# Altium schematic sheet LPCB221 - G210X INTERFACE.SchDoc
size A3; Address1: Factory 10; Address2: 9-13 Dingley Avenue, Dandeong, VICTORIA 3175, AUSTRALIA; DocumentNumber: 3; Revision: 1; SheetNumber: 3; SheetTotal: 6; Lockie__PCB_SUB_ASSEMBLY: G210X Interface; Lockie__PCB_ASSEMBLY: Node Base; Lockie__LDL: LPCB221; Lockie__PCB_DESCRIPTION: Gimbal Node
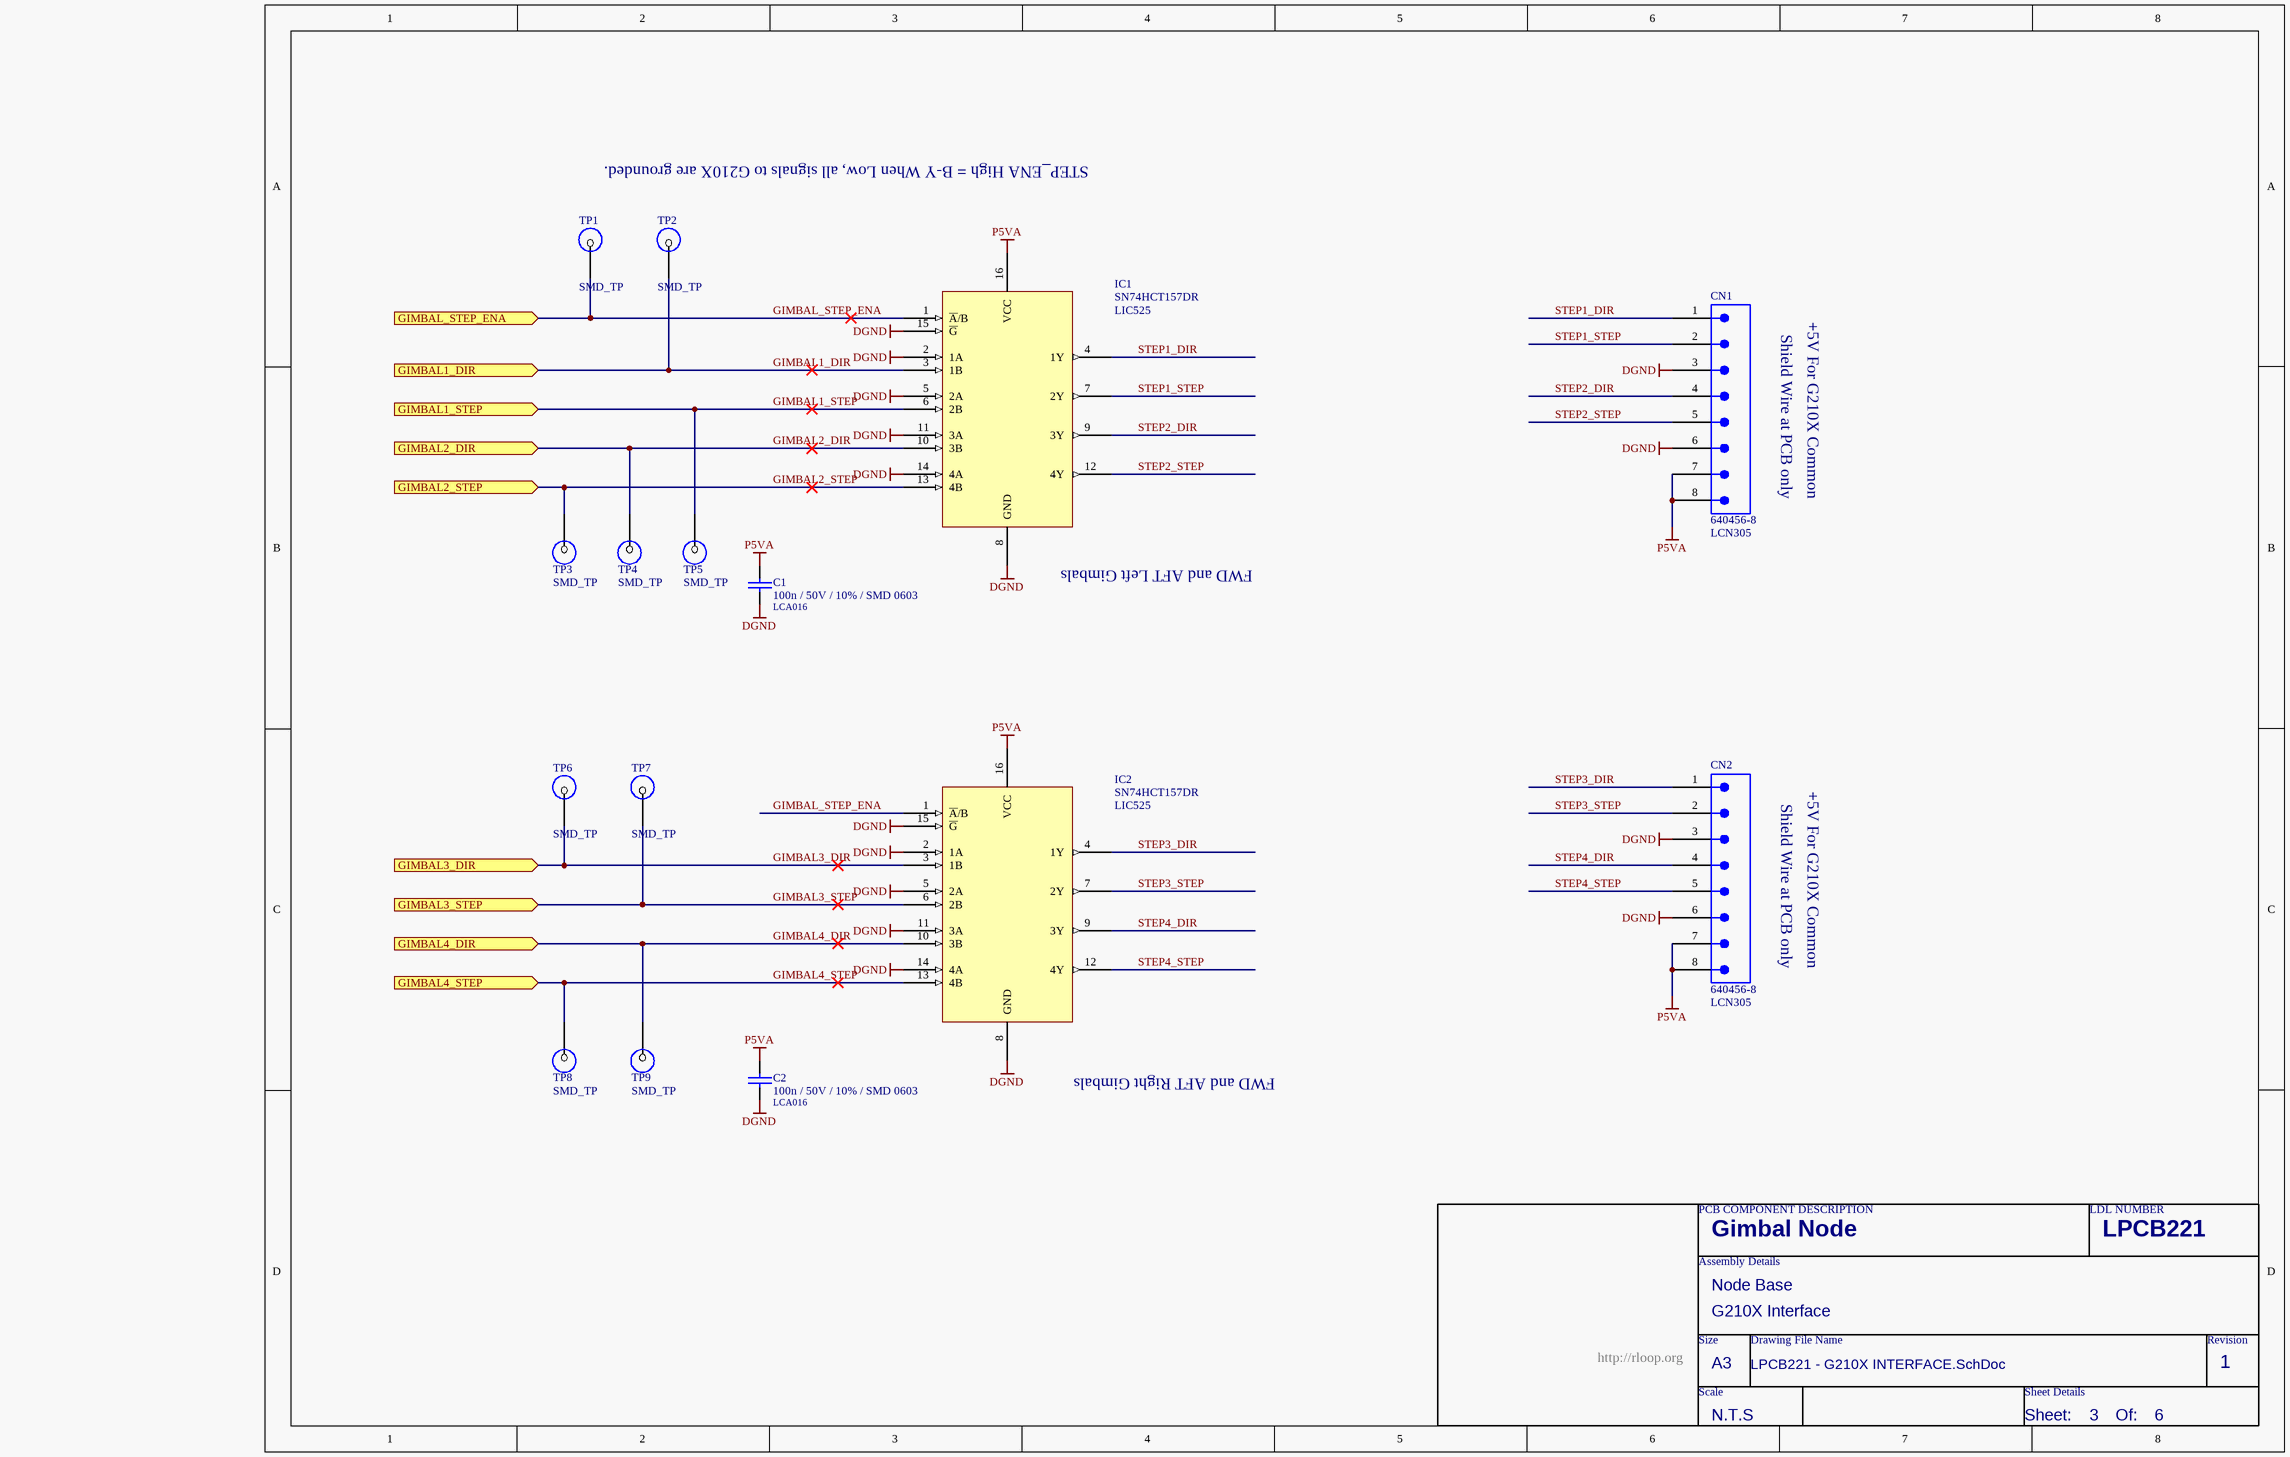
[diagram p0: LPCB221 - G210X INTERFACE.SchDoc]

## Parts
C1  100n / 50V / 10% / SMD 0603  LDL_NUMBER: LCA016  [LFP011__CC1608-0603-IPC7351_B]
C2  100n / 50V / 10% / SMD 0603  LDL_NUMBER: LCA016  [LFP011__CC1608-0603-IPC7351_B]
CN1  640456-8  LDL_NUMBER: LCN305  [640456-8]
CN2  640456-8  LDL_NUMBER: LCN305  [640456-8]
IC1  SN74HCT157DR  LDL_NUMBER: LIC525  [LFP079__SOP16]
IC2  SN74HCT157DR  LDL_NUMBER: LIC525  [LFP079__SOP16]
TP1  SMD_TP  [SMD-TP]  (no BOM)
TP2  SMD_TP  [SMD-TP]  (no BOM)
TP3  SMD_TP  [SMD-TP]  (no BOM)
TP4  SMD_TP  [SMD-TP]  (no BOM)
TP5  SMD_TP  [SMD-TP]  (no BOM)
TP6  SMD_TP  [SMD-TP]  (no BOM)
TP7  SMD_TP  [SMD-TP]  (no BOM)
TP8  SMD_TP  [SMD-TP]  (no BOM)
TP9  SMD_TP  [SMD-TP]  (no BOM)

## Ports
GIMBAL1_DIR (in), GIMBAL1_STEP (in), GIMBAL2_DIR (in), GIMBAL2_STEP (in), GIMBAL3_DIR (in), GIMBAL3_STEP (in), GIMBAL4_DIR (in), GIMBAL4_STEP (in), GIMBAL_STEP_ENA (in)

## Nets
DGND: C1.2 C2.2 CN1.3 CN1.6 CN2.3 CN2.6 IC1.2(1A) IC1.5(2A) IC1.8(GND) IC1.11(3A) IC1.14(4A) IC1.15(~{G}) IC2.2(1A) IC2.5(2A) IC2.8(GND) IC2.11(3A) IC2.14(4A) IC2.15(~{G})
P5VA: C1.1 C2.1 CN1.7 CN1.8 CN2.7 CN2.8 IC1.16(VCC) IC2.16(VCC)
GIMBAL1_DIR: IC1.3(1B) TP2.1 ; port GIMBAL1_DIR
GIMBAL1_STEP: IC1.6(2B) TP5.1 ; port GIMBAL1_STEP
GIMBAL2_DIR: IC1.10(3B) TP4.1 ; port GIMBAL2_DIR
GIMBAL2_STEP: IC1.13(4B) TP3.1 ; port GIMBAL2_STEP
GIMBAL3_DIR: IC2.3(1B) TP6.1 ; port GIMBAL3_DIR
GIMBAL3_STEP: IC2.6(2B) TP7.1 ; port GIMBAL3_STEP
GIMBAL4_DIR: IC2.10(3B) TP9.1 ; port GIMBAL4_DIR
GIMBAL4_STEP: IC2.13(4B) TP8.1 ; port GIMBAL4_STEP
GIMBAL_STEP_ENA: IC1.1(~{A}/B) IC2.1(~{A}/B) TP1.1 ; port GIMBAL_STEP_ENA
STEP1_DIR: CN1.1 IC1.4(1Y)
STEP1_STEP: CN1.2 IC1.7(2Y)
STEP2_DIR: CN1.4 IC1.9(3Y)
STEP2_STEP: CN1.5 IC1.12(4Y)
STEP3_DIR: CN2.1 IC2.4(1Y)
STEP3_STEP: CN2.2 IC2.7(2Y)
STEP4_DIR: CN2.4 IC2.9(3Y)
STEP4_STEP: CN2.5 IC2.12(4Y)

## Notes on the sheet
- STEP_ENA High = B-Y When Low, all signals to G210X are grounded.
- Shield Wire at PCB only
- +5V For G210X Common
- (near IC1) FWD and AFT Left Gimbals
- FWD and AFT Right Gimbals
- PCB COMPONENT DESCRIPTION
- LDL NUMBER
- Assembly Details
- Size
- Drawing File Name
- Revision
- http://rloop.org
- Scale
- A3
- Sheet Details
- N.T.S
- Sheet:
- Of:

## Library data of the parts
C1 C2 = 100n / 50V / 10% / SMD 0603: Capacitor, Ceramic Chip, 100nF (0.1uF), 50V, 5%, SMD 0603 [LCA016]; FMEDA__OPERATING__VOLTAGE_MIN: 0; FMEDA__OPERATING__VOLTAGE_MAX: 3.3; FMEDA__OPERATING__TEMP_MIN: -20; FMEDA__OPERATING__TEMP_TYP: 27; FMEDA__OPERATING__TEMP_MAX: 50; FMEDA__CHANNEL: COM; Value: 100n; FMEDA__FUNCTION_IN_SYSTEM: *; FMEDA__OPERATING__VOLTAGE_TYP: 3.3
CN1 CN2 = 640456-8: Connector, Male Header, 8 Way; FMEDA__CHANNEL: COM; FMEDA__OPERATING__CURRENT_MAX: 0; FMEDA__OPERATING__TEMP_MAX: 50; FMEDA__OPERATING__TEMP_MIN: -20; FMEDA__OPERATING__TEMP_TYP: 27; FMEDA__OPERATING__VOLTAGE_MAX: 16; FMEDA__OPERATING__VOLTAGE_TYP: 12; FMEDA__FUNCTION_IN_SYSTEM: *; FMEDA__OPERATING__CURRENT_MIN: 0; FMEDA__OPERATING__CURRENT_TYP: 0; FMEDA__OPERATING__VOLTAGE_MIN: 0
IC1 IC2 = SN74HCT157DR: IC, Multiplexer Select 2-1 [LIC525]; FMEDA__CHANNEL: COM; FMEDA__FUNCTION_IN_SYSTEM: *
TP1-TP9 = SMD_TP: SMD Test Point; FMEDA__CHANNEL: COM; FMEDA__OPERATING__CURRENT_MAX: 0; FMEDA__OPERATING__TEMP_MAX: 50; FMEDA__OPERATING__TEMP_MIN: -20; FMEDA__OPERATING__TEMP_TYP: 27; FMEDA__OPERATING__VOLTAGE_MAX: 16; FMEDA__OPERATING__VOLTAGE_TYP: 12; FMEDA__OPERATING__CURRENT_MIN: 0; FMEDA__OPERATING__CURRENT_TYP: 0; FMEDA__OPERATING__VOLTAGE_MIN: 0